# EasyEDA Pro project ProPrj_USB_FLARM_UPDATER_2026-05-29.epro, board PCB1
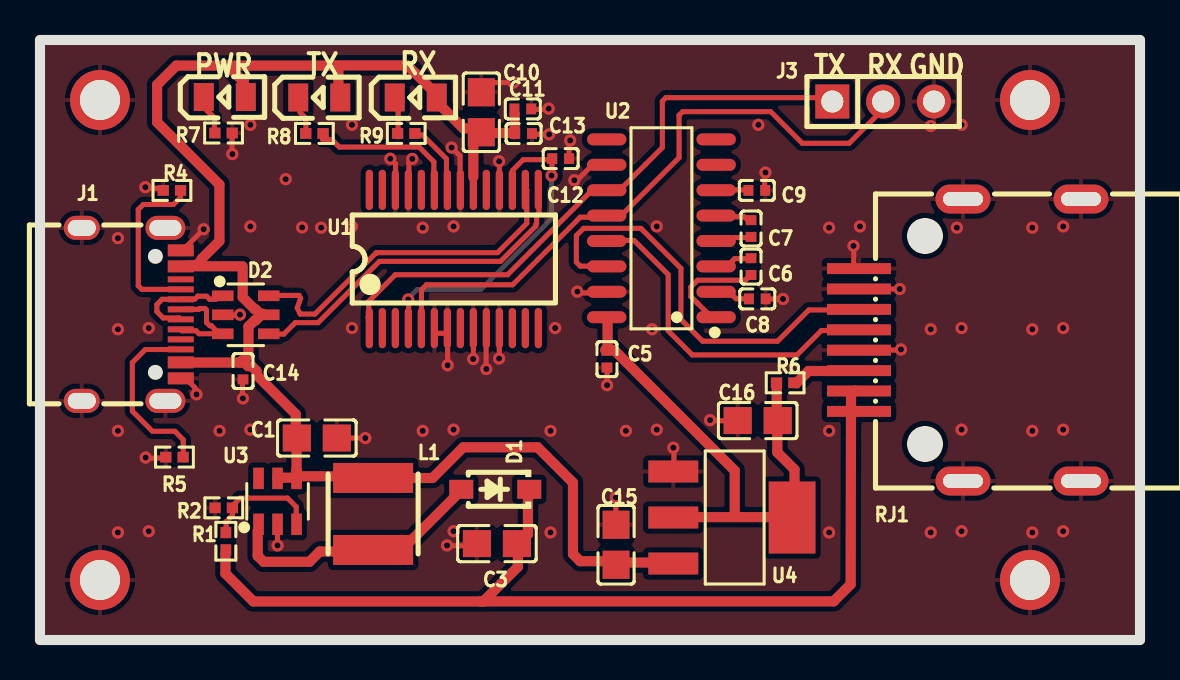
[diagram p1: board, top side]
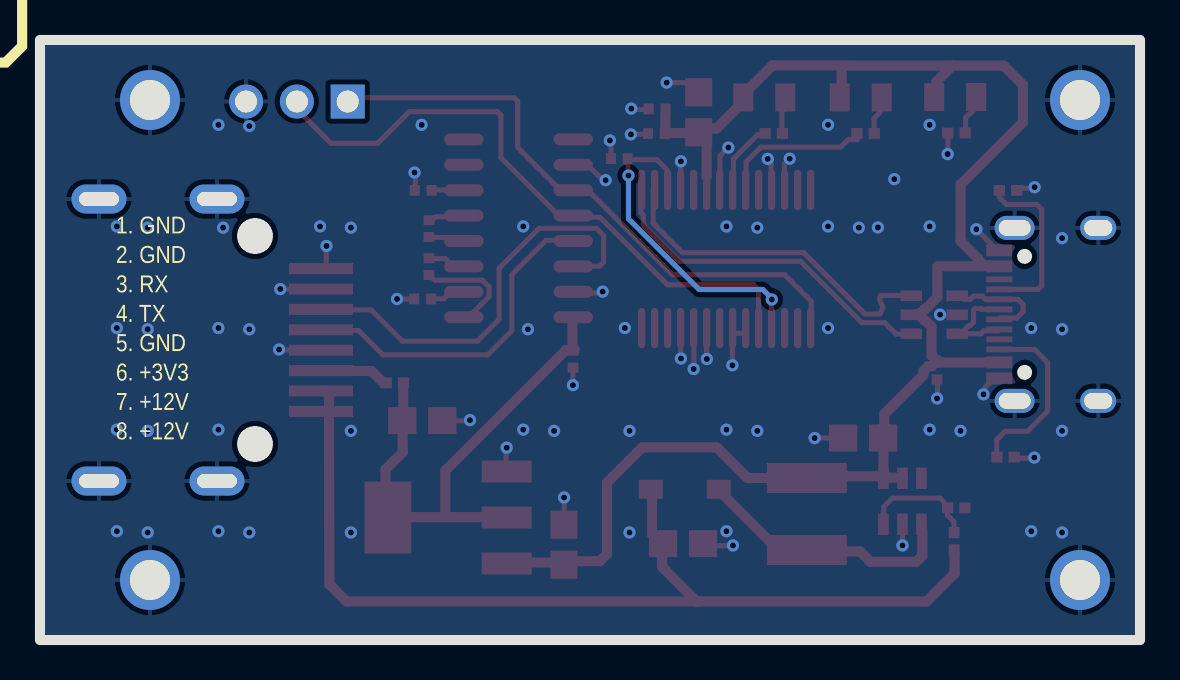
[diagram p2: board, bottom side, seen from below]

Outline 55 x 30 mm; copper layers: Top Layer, Bottom Layer. Coordinates in mm from the lower left corner of the outline.
Outline path: rectangle 0,30 55,0
Stack: Top Layer 0.035mm / Dielectric1 1.51mm FR4 er 4.5 / Bottom Layer 0.035mm

## Design rules (mm)
net VUSB: Power
net V12_OUT: Power_12V
net UD+: DP1
net UD-: DP1
net UD_IN+: DP2
net UD_IN-: DP2
template: Custom Config
spacing copperThickness1oz (default): track to track 0.102, other pairs 0.152 to 0.3
spacing copperThickness2oz: track to track 0.203, other pairs 0.152 to 0.3
track width copperThickness1oz (default): min 0.127, default 0.254, max 2.54
track width copperThickness2oz: min 0.203, default 0.254, max 2.54
track width min20mil: min 0.508, default 0.508, max 2.54
track width min15mil: min 0.381, default 0.381, max 2.54
differential pair differentialPair (default): width min 0.127, default 0.254, max 2.54; gap min 0.152, default 0.152
via viaSize (default): diameter min 0.5, default 0.61, max 10; hole min 0.3, default 0.305, max 6.3
net class Power uses min20mil
net class Power_12V uses min15mil
net VUSB uses min20mil
net V12_OUT uses min15mil

## Placement (name value [footprint] x y rotation side)
C1  22uF  [C0805]  13.84 10.1 0 top
C3  22uF  [C0805]  22.85 4.82 180 top
C5  100nF  [C0402]  28.35 14.04 90 top
C6  100nF  [C0402]  35.55 18.67 90 top
C7  100nF  [C0402]  35.55 20.57 90 top
C8  100nF  [C0402]  35.86 17.06 0 top
C9  100nF  [C0402]  35.84 22.48 0 top
C10  4.7uF  [C0805]  22.07 26.39 270 top
C11  100nF  [C0402]  24.14 26.55 180 top
C12  100nF  [C0402]  26.03 24.07 180 top
C13  100nF  [C0402]  24.18 25.32 180 top
C14  100nF  [C0402]  10.15 13.45 270 top
C15  22uF  [C0805]  28.8 4.76 270 top
C16  22uF  [C0805]  35.88 10.97 0 top
D1  B5819W SL  [SOD-123_L2.7-W1.6-LS3.7-RD-1]  22.76 7.53 180 top
D2  USBLC6-2SC6  [SOT-23-6_L2.9-W1.6-P0.95-LS2.8-BL]  10.29 16.26 270 top
J1  TYPE-C-31-M-12  [USB-C_SMD-TYPE-C-31-M-12_1]  4.56 16.28 270 top
J3  -  [HDR-TH_3P-P2.54-V-M]  42.16 26.92 0 top
L1  22uH  [IND-SMD_L4.0-W4.0_LQH44PN2R2MP0L]  16.66 6.3 90 top
LED1  KT-0805G  [LED0805-R-RD]  9.24 27.15 0 top
LED2  KT-0805Y  [LED0805-R-RD]  13.96 27.13 0 top
LED3  KT-0805Y  [LED0805-R-RD]  18.79 27.13 0 top
NOREF  -  [Pad_e752]  3 27 0 top
NOREF#2  -  [Pad_e961]  3 3 0 top
NOREF#3  -  [Pad_e1501]  49.5 27 0 top
NOREF#4  -  [Pad_e1500]  49.5 3 0 top
R1  100kΩ  [R0402]  9.29 4.94 270 top
R2  5.1kΩ  [R0402]  9.19 6.61 0 top
R4  5.1kΩ  [R0402]  6.6 22.48 0 top
R5  5.1kΩ  [R0402]  6.72 9.14 0 top
R6  10Ω  [R0402]  37.26 12.86 0 top
R7  680Ω  [R0402]  9.18 25.35 0 top
R8  680Ω  [R0402]  13.72 25.33 0 top
R9  680Ω  [R0402]  18.31 25.33 0 top
RJ1  RJ-064-1  [CONN-SMD_RJ-064]  46.5 15 90 top
U1  FT232RL-REEL  [SSOP-28_L10.2-W5.3-P0.65-LS7.8-BL]  20.69 19.05 0 top
U2  MAX3232CSE+T  [SOIC-16_L9.9-W3.9-P1.27-LS6.0-BL]  31.07 20.59 90 top
U3  MT3608  [SOT-23-6_L2.9-W1.6-P0.95-LS2.8-BL]  11.88 6.93 0 top
U4  AMS1117-3.3  [SOT-223-3_L6.5-W3.4-P2.30-LS7.0-BR]  34.63 6.12 180 top

## Footprints (pads in the part's own frame, mm; a bottom-side part is the same pattern mirrored in y, then rotated)
C0402
  rect 0.5x0.54 smd: 1(-0.42,0) 2(0.42,0)
C0805
  rect 1.41x1.35 smd: 1(-1,0) 2(1,0)
CONN-SMD_RJ-064
  rect 0.55x3.2 smd: 1(3.57,5.55) 2(2.55,5.55) 3(1.53,5.55) 4(0.51,5.55) 5(-0.51,5.55) 6(-1.53,5.55) 7(-2.55,5.55) 8(-3.57,5.55)
  oval 1.45x2.75 hole 0.7x2: 9(7.05,0.35) 10(-7.05,0.35) 11(7.05,-5.55) 12(-7.05,-5.55)
HDR-TH_3P-P2.54-V-M
  rect 1.7x1.7 hole 1.1: 1(-2.54,0)
  round 1.7 hole 1.1: 2(0,0) 3(2.54,0)
IND-SMD_L4.0-W4.0_LQH44PN2R2MP0L
  rect 1.5x4 smd: 1(-1.8,0) 2(1.8,0)
LED0805-R-RD
  rect 1x1.399 smd: 1(1.05,0) 2(-1.05,0)
Pad_e752
  round 3 hole 2: 1(0,0)
Pad_e961
  round 3 hole 2: 1(0,0)
Pad_e1500
  round 3 hole 2: 1(0,0)
Pad_e1501
  round 3 hole 2: 1(0,0)
R0402
  rect 0.566x0.54 smd: 1(-0.433,0) 2(0.433,0)
SOD-123_L2.7-W1.6-LS3.7-RD-1
  rect 1.2x0.95 smd: 1(-1.7,0) 2(1.7,0)
SOIC-16_L9.9-W3.9-P1.27-LS6.0-BL
  oval 0.602x1.971 smd: 1(-4.445,-2.736) 2(-3.175,-2.736) 3(-1.905,-2.736) 4(-0.635,-2.736) 5(0.635,-2.736) 6(1.905,-2.736) 7(3.175,-2.736) 8(4.445,-2.736) 9(4.445,2.736) 10(3.175,2.736) 11(1.905,2.736) 12(0.635,2.736) 13(-0.635,2.736) 14(-1.905,2.736) 15(-3.175,2.736) 16(-4.445,2.736)
SOT-23-6_L2.9-W1.6-P0.95-LS2.8-BL
  rect 0.532x1.072 smd: 1(-0.95,-1.149) 2(0,-1.149) 3(0.95,-1.149) 4(0.95,1.149) 5(0,1.149) 6(-0.95,1.149)
SOT-223-3_L6.5-W3.4-P2.30-LS7.0-BR
  rect 2.5x1.1 smd: 1(2.97,-2.3) 2(2.97,0) 3(2.97,2.3)
  rect 2.34x3.6 smd: 4(-2.97,0)
SSOP-28_L10.2-W5.3-P0.65-LS7.8-BL
  oval 0.364x2.015 smd: 1(-4.225,-3.455) 2(-3.575,-3.455) 3(-2.925,-3.455) 4(-2.275,-3.455) 5(-1.625,-3.455) 6(-0.975,-3.455) 7(-0.325,-3.455) 8(0.325,-3.455) 9(0.975,-3.455) 10(1.625,-3.455) 11(2.275,-3.455) 12(2.925,-3.455) 13(3.575,-3.455) 14(4.225,-3.455) 15(4.225,3.455) 16(3.575,3.455) 17(2.925,3.455) 18(2.275,3.455) 19(1.625,3.455) 20(0.975,3.455) 21(0.325,3.455) 22(-0.325,3.455) 23(-0.975,3.455) 24(-1.625,3.455) 25(-2.275,3.455) 26(-2.925,3.455) 27(-3.575,3.455) 28(-4.225,3.455)
USB-C_SMD-TYPE-C-31-M-12_1
  oval 1.2x2 hole 0.8x1.6: 1(4.325,1.706) 4(-4.325,1.706)
  oval 1.2x1.8 hole 0.8x1.4: 2(4.325,-2.474) 3(-4.325,-2.474)
  custom 0.6x1.3 smd: A1B12(-3.2,2.474) A4B9(-2.4,2.474) B1A12(3.2,2.474) B4A9(2.401,2.474)
  rect 0.3x1.3 smd: A5(-1.25,2.474) A6(-0.25,2.474) A7(0.25,2.474) A8(1.25,2.474) B5(1.75,2.474) B6(0.75,2.474) B7(-0.75,2.474) B8(-1.75,2.474)

## Nets
As in the schematic, except:
GND: C1.2 C3.2 C5.1 C8.2 C9.2 C10.1 C11.1 C12.1 C13.1 C14.2 C15.1 C16.1 D2.2 J1.1 J1.2 J1.3 J1.4 J1.A1B12 J1.B1A12 J3.3 NOREF.1 NOREF#2.1 NOREF#3.1 NOREF#4.1 R2.1 R4.1 R5.1 R7.2 RJ1.1 RJ1.2 RJ1.5 RJ1.9 RJ1.10 RJ1.11 RJ1.12 U1.6 U1.7 U1.9 U1.10 U1.11 U1.18 U1.21 U1.25 U1.26 U2.10 U2.15 U3.2 U4.1

Pads without a net: J1 A8 B8; U1 2 3 8 12 13 14 19 24 27 28; U2 7 8 9; U3 6

## Via types
v1: diameter 0.61, hole 0.305, Top Layer to Bottom Layer, 84 vias

## Routing (per net, layer and track width the routed paths; a pad name or vN(x,y) marks a point on that pad's centre or on a via; arc(x,y) is an arc through that point)
GND: length 33.2
  Top Layer w0.254: 6.33,9.14 6.28,9.09 5.33,9.09 ; 9.6,24.35 9.6,25.12 9.68,25.19 ; 26.95,17.36 26.96,17.35 28.04,17.35 ; 9.1,16.16 9.02,16.23 9.96,16.23 v1(10,16.27) ; v1(8.18,20.54) 7.23,19.58 7.21,19.58 ; 42.28,17.57 42.31,17.55 v1(42.99,17.55) ; 24.55,26.53 25.24,26.53 25.25,26.54 ; 21.67,14.05 21.67,14.87 21.69,14.89 ; 36.23,22.49 36.23,23.29 36.22,23.3 ; 25.36,25.25 25.31,25.29 24.6,25.29 ; 22.96,14.05 22.96,14.93 22.99,14.95 ; 31.68,8.64 31.7,8.66 31.7,9.53 ; 20.34,4.71 21.67,4.71 21.72,4.66 ; 22.33,14.75 22.31,14.73 22.31,13.57 ; 14.86,10.05 14.9,10.1 16.25,10.1 ; 18.45,23.34 18.45,23.89 v1(18.61,24.05) ; 6.07,22.45 5.94,22.59 5.4,22.59 ; 21,23.16 21,24.2 v1(20.58,24.62) ; 40.7,19.73 40.69,19.71 40.69,18.71 40.69,18.71 ; 19.76,15.37 19.8,15.33 20.32,15.33 ; 17.78,23.16 17.78,23.8 v1(17.51,24.06) ; 27.58,23.71 26.92,23.05 26.78,23.05 ; 7.74,12.45 7.74,12.62 7.31,13.05 ; 42.15,14.5 43.02,14.5 v1(43.05,14.53) ; 28.35,12.75 28.35,13.46 28.3,13.52 ; 10.12,12.89 10.12,12.23 10.14,12.22 ; v1(22.96,23.93) 22.97,23.92 22.97,23.35 ; 26.45,24.08 26.45,24.84 26.46,24.85 ; 20.38,14.72 v1(20.38,13.74) ; 22.33,27.74 22.46,27.87 23.68,27.87 ; v1(11.88,4.73) 11.88,5.92 11.93,5.97 ; v1(37.15,17.05) 36.34,17.05 ; 28.86,6.15 28.79,6.22 28.79,7.06 ; 34.79,10.89 34.72,10.96 33.53,10.96
  vias: v1(3.9,20.09) v1(3.9,15.54) v1(3.9,10.46) v1(3.9,5.38) v1(5.27,22.64) v1(5.28,9.12) v1(5.44,15.6) v1(5.44,5.44) v1(7.83,12.28) v1(8.98,10.46) v1(9.62,24.3) v1(10.15,12.08) v1(10.52,25.76) v1(10.52,20.68) v1(10.52,10.52) v1(12.29,23.04) v1(13.11,20.63) v1(14.06,20.62) v1(15.6,25.76) v1(15.6,20.68) v1(15.6,15.6) v1(16.27,10.1) v1(19.14,20.62) v1(19.14,10.46) v1(20.35,4.73) v1(20.68,20.68) v1(20.68,10.52) v1(20.68,5.44) v1(21.66,14.05) v1(22.32,13.55) v1(22.95,14.07) v1(23.67,27.87) v1(25.44,26.57) v1(25.46,25.28) v1(25.53,10.46) v1(25.53,5.38) v1(25.76,15.6) v1(26.51,24.98) v1(26.72,22.99) v1(26.87,17.42) v1(28.35,12.74) v1(28.8,7.13) v1(29.3,10.46) v1(30.6,15.54) v1(30.84,20.68) v1(30.84,10.52) v1(31.67,9.62) v1(33.5,10.99) v1(35.92,25.76) v1(36.27,23.37) v1(39.46,20.62) v1(39.46,10.46) v1(39.46,5.38) v1(40.68,19.7) v1(41,20.68) v1(44.54,25.7) v1(44.54,15.54) v1(44.54,5.38) v1(45.84,20.62) v1(46.08,25.76) v1(46.08,15.6) v1(46.08,10.52) v1(46.08,5.44) v1(49.62,20.62) v1(49.62,15.54) v1(49.62,10.46) v1(49.62,5.38) v1(51.16,20.68) v1(51.16,15.6) v1(51.16,10.52) v1(51.16,5.44)
V3V3: length 25.2
  Top Layer w0.508: 28.38,14.5 28.38,15.99 28.42,16.04 ; 28.38,14.5 28.26,14.5 ; 28.38,14.5 28.7,14.5 34.74,8.47 34.74,6.32 ; 36.84,11.1 36.84,12.73 ; 36.87,10.61 36.87,9.38 37.73,8.52 37.73,6.07 37.66,6.14 31.74,6.14
V3V3_OUT: length 2
  Top Layer w0.508: 39.5,13.45 38.43,13.45 37.82,12.85 37.77,12.85
V12_OUT: length 48.8
  Top Layer w0.508: 23.92,4.81 24.4,5.29 24.4,7.2 ; 22.02,1.93 10.67,1.93 9.27,3.32 9.27,4.3 ; 22.02,1.93 22.16,1.93 22.17,1.93 ; 22.02,1.93 22.17,1.93 ; 23.9,4.3 23.9,3.66 22.17,1.93 ; 22.17,1.93 39.68,1.93 40.53,2.78 40.55,12.27 40.76,12.47
CC1: length 8.7
  Top Layer w0.254: J1.A5 5.09,17.53 4.91,17.71 4.91,21.52 5.17,21.78 6.67,21.78 7.03,22.13 7.03,22.48
CC2: length 9
  Top Layer w0.254: 7.16,9.22 7.16,10.02 6.74,10.44 5.62,10.44 4.62,11.44 4.62,13.87 5.27,14.52 7.03,14.52
CP1N: length 1.4
  Top Layer w0.254: 34.4,18.73 34.73,19.07 35.63,19.07
CP1P: length 5.1
  Top Layer w0.254: 33.5,16.14 33.5,16.22 32.89,16.83 32.88,16.83 32.54,17.17 32.54,17.65 32.88,17.99 35.27,17.99 35.52,18.25
CP2N: length 0.8
  Top Layer w0.254: 34.61,21.16 35.22,21.16 35.39,20.99
CP2P: length 0.9
  Top Layer w0.254: 35.5,20.12 34.7,20.12 34.6,20.03
FB: length 5.4
  Top Layer w0.254: 9.35,5.58 9.31,5.62 9.31,5.92 9.62,6.23 9.62,6.7 ; 9.68,6.77 10,7.09 12.38,7.09 12.81,6.66 12.81,5.94
FT_3V3: length 14.4
  Top Layer w0.254: 18.41,16.38 18.43,16.4 18.43,17.04 ; 25.6,24.02 24.16,24.02 23.62,23.47 ; 25.62,23.85 25.6,23.83 25.6,23.24
  Bottom Layer w0.254: 18.43,17.1 18.86,17.53 22.04,17.53 25.58,21.06 v1(25.58,23.22)
  vias: v1(18.41,17.03)
LED1_K: length 1.7
  Top Layer w0.254: 7.94,26.88 8.52,26.3 ; 8.53,26.31 8.72,26.12 8.72,25.46
LED2_K: length 1.3
  Top Layer w0.254: 13.29,25.24 13.29,26.09 12.99,26.39
LED3_K: length 1.4
  Top Layer w0.254: 17.91,25.16 17.91,26.46 17.86,26.51
RS232_RX: length 15.4
  Top Layer w0.254: 28.94,19.98 29.7,19.98 31.41,18.27 31.41,15.48 ; 39.78,15.46 39.7,15.38 39.52,15.38 39.43,15.47 39.07,15.47 37.85,14.25 32.61,14.25 31.41,15.46
RS232_TX: length 20.1
  Top Layer w0.254: 40.16,16.44 40.09,16.5 38.44,16.5 36.88,14.94 33.13,14.94 32.05,16.03 32.05,18.58 30.05,20.58 27.18,20.58 26.82,20.22 26.82,18.89 27.01,18.69 27.53,18.69 27.53,18.69 27.56,18.69
RXLED: length 2.8
  Top Layer w0.254: 18.84,25.25 19.12,25.25 20.32,24.05 20.32,23.26
SW: length 10.2
  Top Layer w0.508: 10.88,5.48 10.88,4.21 11.18,3.91 13.47,3.91 13.99,4.43 15.16,4.43 15.19,4.45 ; 21.09,7.5 18.3,4.72 17.94,4.72
TXLED: length 6.6
  Top Layer w0.254: 19.68,23.39 19.69,23.4 19.69,23.91 18.95,24.65 14.97,24.65 14.6,25.02 14.15,25.02 14.12,25.05
UART_RX: length 30.1
  Top Layer w0.254: 27.63,21.14 27.01,21.14 23.63,17.76 19.33,17.76 19.07,17.51 19.07,15.74 19.04,15.7 ; 42.16,26.55 42.16,26.54 40.46,24.84 38.12,24.84 36.53,26.42 32.13,26.42 31.95,26.24 31.95,24.12 29.04,21.2 28.68,21.2
UART_TX: length 27.4
  Top Layer w0.254: 30.29,23.8 31.12,24.62 31.12,26.94 31.3,27.12 38.92,27.12 38.92,26.97 ; 30.29,23.8 29.14,22.65 29.14,22.61 ; 30.29,23.8 30.26,23.76 ; 16.4,16.13 16.44,16.17 16.44,16.94 17.77,18.26 23.38,18.26 27.54,22.43 27.54,22.46
UD+: length 17.3
  Top Layer w0.254: 11.67,15.3 12.19,15.3 12.76,15.87 13.91,15.87 16.97,18.93 23.03,18.93 24.79,20.69 24.79,20.77 24.83,20.81 24.83,21.24 24.95,21.36 24.95,22.45 24.92,22.49 U1.15
UD-: length 17.3
  Top Layer w0.254: U1.16 24.27,22.52 24.28,22.53 24.32,22.53 24.34,22.51 24.34,20.83 22.87,19.37 16.86,19.37 16.85,19.36 16.82,19.36 16.82,19.35 16.8,19.35 13.74,16.3 13.01,16.3 12.86,16.6 13.03,17.08 12.96,17.23 11.73,17.23 11.72,17.22 11.72,17.21
UD_IN+: length 4.8
  Top Layer w0.254: J1.A6 7.94,16.53 7.99,16.58 8.24,16.58 8.32,16.5 8.32,15.88 8.49,15.72 8.57,15.72 8.97,15.31 ; J1.B6 7.11,15.46 7.8,15.46 7.95,15.31 8.87,15.31
UD_IN-: length 4.8
  Top Layer w0.254: J1.A7 6.97,16.1 6.16,16.1 5.84,16.42 5.84,16.77 6.11,17.04 6.48,17.04 6.48,17.03 ; D2.1 9.13,17.21 8.97,17.21 8.79,17.04 8.48,17.04 8.33,17.19 7.89,17.19 7.74,17.04 7.04,17.04 J1.B7
VS_NEG: length 1
  Top Layer w0.254: 34.38,22.5 35.3,22.5 35.33,22.53
VS_POS: length 0.8
  Top Layer w0.254: 34.55,17.31 34.8,17.06 35.27,17.06
VUSB: length 74.2
  Top Layer w0.508: 12.79,8.11 12.83,8.08 ; 12.83,9.88 12.83,8.2 ; 23.73,25.38 23.73,26.32 ; 11.12,16.32 10.78,15.98 10.73,15.98 10.42,15.67 10.42,14.23 10.14,13.94 ; 12.79,10.69 12.79,11.29 10.83,13.25 10.83,13.45 10.59,13.69 10.39,13.69 ; 30.84,3.85 30.82,3.87 28.63,3.87 ; 9.37,28.72 10.19,27.91 10.19,27.67 ; 9.37,28.72 14.64,28.72 ; 9.37,28.72 6.82,28.72 5.86,27.76 5.86,25.89 8.97,22.77 8.97,19.95 8.09,19.07 8.09,19.01 7.83,18.75 7.11,18.69 10.13,18.69 ; 14.97,8.17 14.95,8.19 12.86,8.19 ; 19.94,26.8 21.16,25.58 21.67,25.58 ; 7.12,13.87 10.1,13.87 ; 19.72,27.39 18.37,28.73 14.67,28.73 ; 11.02,16.29 10.77,16.54 10.73,16.54 10.13,17.14 10.13,18.58 ; 11.87,8.12 12.79,8.12 ; 14.92,27.35 14.92,28.44 ; 10.14,13.94 10.1,13.98 ; 10.14,13.94 10.11,13.91 ; 16.82,8.1 19.63,8.1 21.16,9.63 24.88,9.63 26.65,7.87 26.65,4.3 27.01,3.94 28.3,3.94 ; 22.34,25.35 23.64,25.35 ; 23.67,25.31 23.7,25.29 ; 21.69,24.89 21.67,24.86 21.67,23.15

## Copper pours and planes (outline as drawn; the poured copper is in the pictures)
GND on Top Layer: -0.15,30.18 55.24,30.18 55.24,-0.27 -0.15,-0.27
GND on Bottom Layer: -0.38,30.23 55.06,30.23 55.06,-0.28 -0.38,-0.28

## Text on the board
Bottom Silkscreen Layer: 1. GND / 2. GND / 3. RX / 4. TX / 5. GND / 6. +3V3 / 7. +12V / 8. +12V
Top Silkscreen Layer: TX | RX | GND | PWR
